# Altium project PCB_HeatSensorEE1.PrjPcb
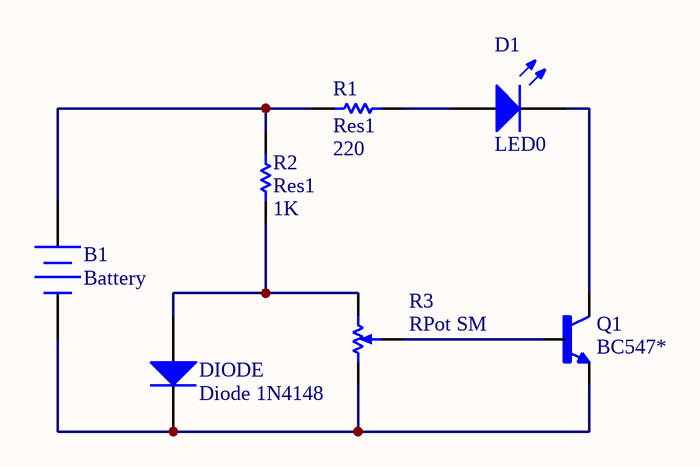
[diagram p0: Sheet1.SchDoc]
1 sheet, 7 parts. Net scope: global (net labels, ports and power ports of the same name join across sheets).
Board file: PCB2.PcbDoc

## Sheet Sheet1.SchDoc
size A4; SheetNumber: 1; SheetTotal: 1

### Parts
B1  Battery  [BAT-2]
D1  LED0  [LED-0]
DIODE  Diode 1N4148  [DO-35]
Q1  BC547*  [TO92]
R1  Res1  value 220  [AXIAL-0.3]
R2  Res1  value 1K  [AXIAL-0.3]
R3  RPot SM  [POT4MM-2]

### Nets
NetB1_1: B1.1(+) R1.1 R2.2
NetB1_2: B1.2(-) DIODE.2(K) Q1.1(E) R3.CCW(-)
NetD1_1: D1.1(A) R1.2
NetD1_2: D1.2(K) Q1.3(C)
NetDIODE_1: DIODE.1(A) R2.1 R3.CW(+)
NetQ1_2: Q1.2(B) R3.W

### Library data of the parts
B1 = Battery: Multicell Battery; Published: 24-Mar-1999; LatestRevisionDate: 17-Jul-2002; LatestRevisionNote: Re-released for DXP Platform.; PackageReference: BAT-2; Publisher: Altium Limited; PackageDescription: Battery; 2 Leads
D1 = LED0: Typical INFRARED GaAs LED; Published: 8-Jun-2000; LatestRevisionDate: 08-Jul-2005; LatestRevisionNote: Mech Layer 1 removed.; PackageReference: LED-0; Publisher: Altium Limited; PackageDescription: LED; 2 Leads
DIODE = Diode 1N4148: High Conductance Fast Diode; Published: 8-Jun-2000; LatestRevisionDate: 17-Jul-2002; LatestRevisionNote: Re-released for DXP Platform.; DatasheetVersion: 1997; PackageReference: DO-35; Publisher: Altium Limited; PackageDescription: Diode, Axial; Body 3.8 x 1.9 mm (LxDia. max), Lead Dia. 0.53 mm (max); Code_JEDEC: DO-204-AH; ComponentLink1Description: Manufacturer Link; ComponentLink1URL: http://www.fairchildsemi.com/; ComponentLink2Description: Datasheet; ComponentLink2URL: http://www.fairchildsemi.com/ds/1N%2F1N4148.pdf
Q1 = BC547*: Trans GP BJT NPN 45V 0.1A 500mW 3-Pin TO-92 T/R; MF: ON Semiconductor; MP: BC547; SnapEDA_Link: https://www.snapeda.com/parts/BC547/Onsemi/view-part/?ref=snap; Package: None; Value: *; Check_prices: https://www.snapeda.com/parts/BC547/Onsemi/view-part/?ref=eda
R1 R2 = Res1: Resistor; Published: 8-Jun-2000; LatestRevisionDate: 17-Jul-2002; LatestRevisionNote: Re-released for DXP Platform.; PackageReference: AXIAL-0.3; Publisher: Altium Limited; PackageDescription: Axial Device, Thru-Hole; 2 Leads; 0.3 in Pin Spacing
R3 = RPot SM: Square Trimming Potentiometer; Published: 17-Dec-2003; DatasheetVersion: Oct-2003; PackageReference: POT4MM-2; Publisher: Altium Limited; PackageDescription: Square Trimming Potentiometer; ComponentLink1Description: Manufacturer Link; ComponentLink1URL: http://bourns.com/2/search.html